# EAGLE design PTT (EAGLE 9.3.1)
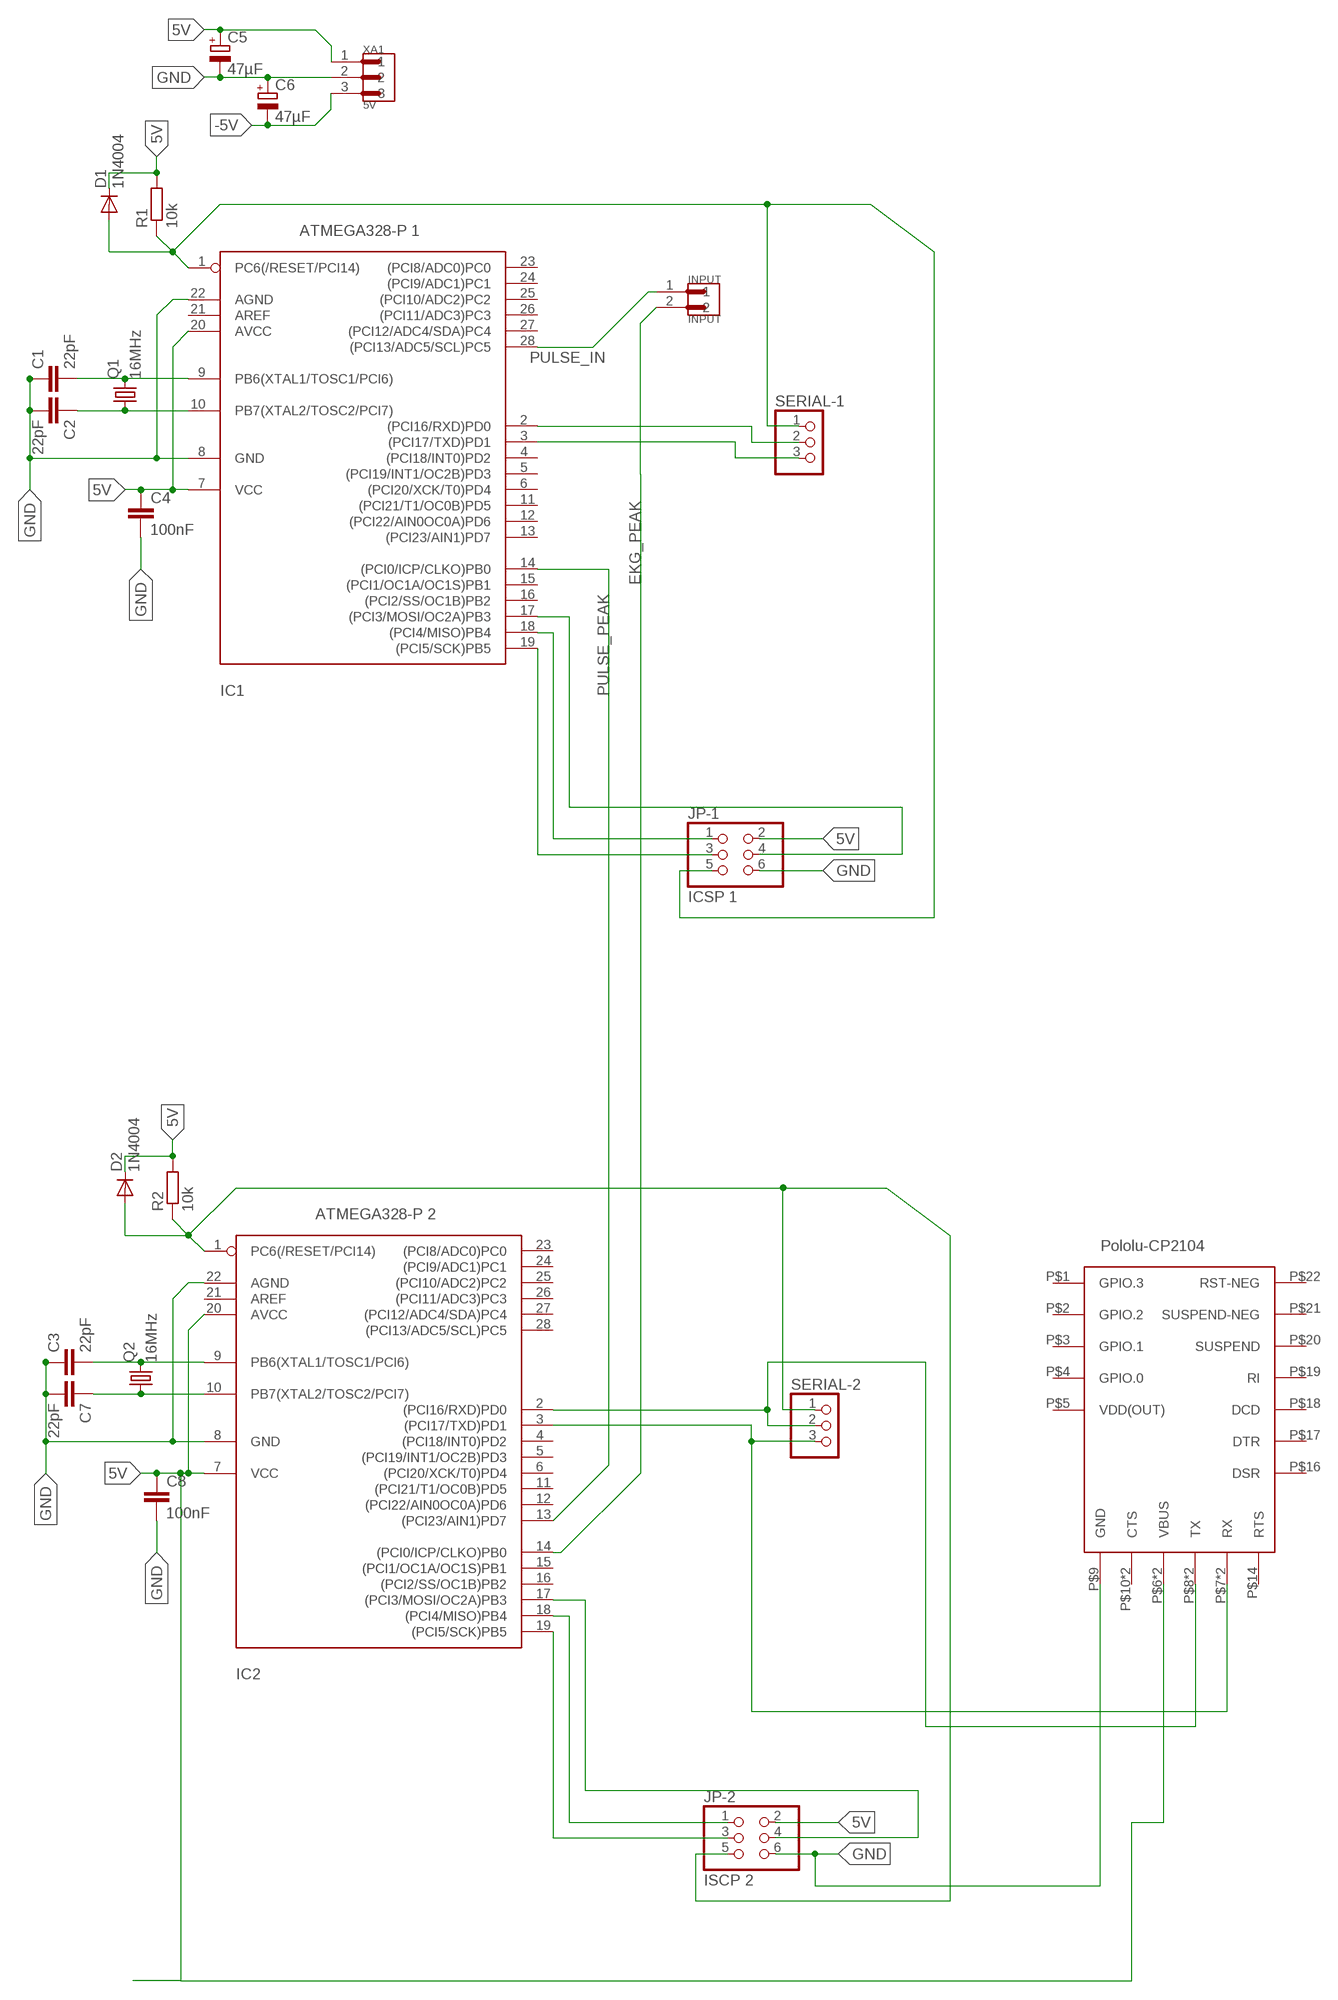
[diagram p0: schematic, sheet 1]

## Parts
C1  22pF  C-EU025-024X044  [C025-024X044]
C2  22pF  C-EU025-024X044  [C025-024X044]
C3  22pF  C-EU025-024X044  [C025-024X044]
C4  100nF  C-EU025-024X044  [C025-024X044]
C5  47µF  CPOL-EUE2,5-6E  [E2,5-6E]
C6  47µF  CPOL-EUE2,5-6E  [E2,5-6E]
C7  22pF  C-EU025-024X044  [C025-024X044]
C8  100nF  C-EU025-024X044  [C025-024X044]
D1  1N4004  [DO41-10]
D2  1N4004  [DO41-10]
IC1  ATMEGA328-P 1  ATMEGA168-20P  [DIL28-3]
IC2  ATMEGA328-P 2  ATMEGA168-20P  [DIL28-3]
INPUT  INPUT  B2P-VH(LF)(SN)  [JST_B2P-VH(LF)(SN)]
JP-1  ICSP 1  PINHD-2X3  [2X03]
JP-2  ISCP 2  PINHD-2X3  [2X03]
Q1  16MHz  CRYSTALHC49U70  [HC49U70]
Q2  16MHz  CRYSTALHC49U70  [HC49U70]
R1  10k  R-EU_0204/7  [0204/7]
R2  10k  R-EU_0204/7  [0204/7]
SERIAL-1  PINHD-1X3  [1X03]
SERIAL-2  PINHD-1X3  [1X03]
U$2  POLOLU_CP2104  [POLOLUCP2104]
XA1  5V  B3P-VH(LF)(SN)  [JST_B3P-VH(LF)(SN)]

## Nets
5V [supply]: C4.1 C5.+ C8.1 D1.C D2.C IC1.7(VCC) IC1.20(AVCC) IC2.7(VCC) IC2.20(AVCC) JP-1.2 JP-2.2 R1.2 R2.2 U$2.P$6(VBUS) U$2.P$11(VBUS) XA1.1
-5V [supply]: C6.- XA1.3
EKG_PEAK: IC2.14((PCI0/ICP/CLKO)PB0) INPUT.2
GND [supply]: C1.1 C2.2 C3.1 C4.2 C5.- C6.+ C7.2 C8.2 IC1.8(GND) IC1.22(AGND) IC2.8(GND) IC2.22(AGND) JP-1.6 JP-2.6 U$2.P$9(GND) XA1.2
N$1: C3.2 IC2.9(PB6(XTAL1/TOSC1/PCI6)) Q2.2
N$2: C7.1 IC2.10(PB7(XTAL2/TOSC2/PCI7)) Q2.1
N$3: IC2.18((PCI4/MISO)PB4) JP-2.1
N$4: IC2.19((PCI5/SCK)PB5) JP-2.3
N$5: IC2.17((PCI3/MOSI/OC2A)PB3) JP-2.4
N$6: IC2.2((PCI16/RXD)PD0) SERIAL-2.2 U$2.P$8(TX) U$2.P$12(TX)
N$7: IC2.3((PCI17/TXD)PD1) SERIAL-2.3 U$2.P$7(RX) U$2.P$13(RX)
N$19: IC1.17((PCI3/MOSI/OC2A)PB3) JP-1.4
N$20: IC1.2((PCI16/RXD)PD0) SERIAL-1.2
N$21: IC1.3((PCI17/TXD)PD1) SERIAL-1.3
N$26: C1.2 IC1.9(PB6(XTAL1/TOSC1/PCI6)) Q1.2
N$27: C2.1 IC1.10(PB7(XTAL2/TOSC2/PCI7)) Q1.1
N$30: IC1.18((PCI4/MISO)PB4) JP-1.1
N$31: IC1.19((PCI5/SCK)PB5) JP-1.3
PULSE_IN: IC1.28((PCI13/ADC5/SCL)PC5) INPUT.1
PULSE_PEAK: IC1.14((PCI0/ICP/CLKO)PB0) IC2.13((PCI23/AIN1)PD7)
RESET: D1.A IC1.1(PC6(/RESET/PCI14)) JP-1.5 R1.1 SERIAL-1.1
RESET1: D2.A IC2.1(PC6(/RESET/PCI14)) JP-2.5 R2.1 SERIAL-2.1
Unconnected: IC1.4((PCI18/INT0)PD2) IC1.5((PCI19/INT1/OC2B)PD3) IC1.6((PCI20/XCK/T0)PD4) IC1.11((PCI21/T1/OC0B)PD5) IC1.12((PCI22/AIN0OC0A)PD6) IC1.13((PCI23/AIN1)PD7) IC1.15((PCI1/OC1A/OC1S)PB1) IC1.16((PCI2/SS/OC1B)PB2) IC1.21(AREF) IC1.23((PCI8/ADC0)PC0) IC1.24((PCI9/ADC1)PC1) IC1.25((PCI10/ADC2)PC2) IC1.26((PCI11/ADC3)PC3) IC1.27((PCI12/ADC4/SDA)PC4) IC2.4((PCI18/INT0)PD2) IC2.5((PCI19/INT1/OC2B)PD3) IC2.6((PCI20/XCK/T0)PD4) IC2.11((PCI21/T1/OC0B)PD5) IC2.12((PCI22/AIN0OC0A)PD6) IC2.15((PCI1/OC1A/OC1S)PB1) IC2.16((PCI2/SS/OC1B)PB2) IC2.21(AREF) IC2.23((PCI8/ADC0)PC0) IC2.24((PCI9/ADC1)PC1) IC2.25((PCI10/ADC2)PC2) IC2.26((PCI11/ADC3)PC3) IC2.27((PCI12/ADC4/SDA)PC4) IC2.28((PCI13/ADC5/SCL)PC5) U$2.P$1(GPIO.3) U$2.P$2(GPIO.2) U$2.P$3(GPIO.1) U$2.P$4(GPIO.0) U$2.P$10(CTS) U$2.P$14(RTS) U$2.P$15(CTS) U$2.P$16(DSR) U$2.P$17(DTR) U$2.P$18(DCD) U$2.P$19(RI) U$2.P$20(SUSPEND) U$2.P$21(SUSPEND-NEG) U$2.P$22(RST-NEG)

## Power pins joined to a net without a drawn wire
VDD(OUT): U$2.P$5(VDD(OUT))

## Library data of the parts
C1-C4 C7 C8 = rcl:C-EU: CAPACITOR, European symbol; SPICEPREFIX: C
C5 C6 = rcl:CPOL-EU: POLARIZED CAPACITOR, European symbol; SPICEPREFIX: C
D1 D2 = diode:1N4004: DIODE general purpose rectifier, 1 A
IC1 IC2 = adafruit:ATMEGA168*P: MICROCONTROLLER 16 kBytes FLASH 1 kBytes SRAM 512 Bytes EEPROM USART 8-channel 10 bit ADC
INPUT = B2P-VH_LF__SN_:B2P-VH(LF)(SN): VH Series 3.96 mm Pitch, Compact, Lock Mechanism also Prevents Misinsertion; AVAILABILITY: Good; DESCRIPTION: VH Series 3.96 mm Pitch, Compact, Lock Mechanism also Prevents Misinsertion; MF: JST; MP: B2P-VH_LF__SN_; PACKAGE: FakePackage u; PRICE: 0.11 USD
JP-1 JP-2 = pinhead:PINHD-2X3: PIN HEADER
Q1 Q2 = adafruit:CRYSTAL: CRYSTAL; OC_FARNELL: unknown; OC_NEWARK: unknown
R1 R2 = rcl:R-EU_: RESISTOR, European symbol; SPICEPREFIX: R
SERIAL-1 SERIAL-2 = pinhead:PINHD-1X3: PIN HEADER
U$2 = POLOLU_CP2104:POLOLU_CP2104: TTL zu USB Konverter
XA1 = B3P-VH_LF__SN_:B3P-VH(LF)(SN): VH Series 3 Position 3.96 mm Pitch Through Hole Crimp Locking Header; AVAILABILITY: Good; DESCRIPTION: VH Series 3 Position 3.96 mm Pitch Through Hole Crimp Locking Header; MF: JST; MP: B3P-VH_LF__SN_; PACKAGE: FakePackage u; PRICE: 0.12 USD

## Net classes
0 signals: width 0.406 mm, clearance 0.305 mm
1 supply: width 0.61 mm, clearance 0.406 mm

## Board
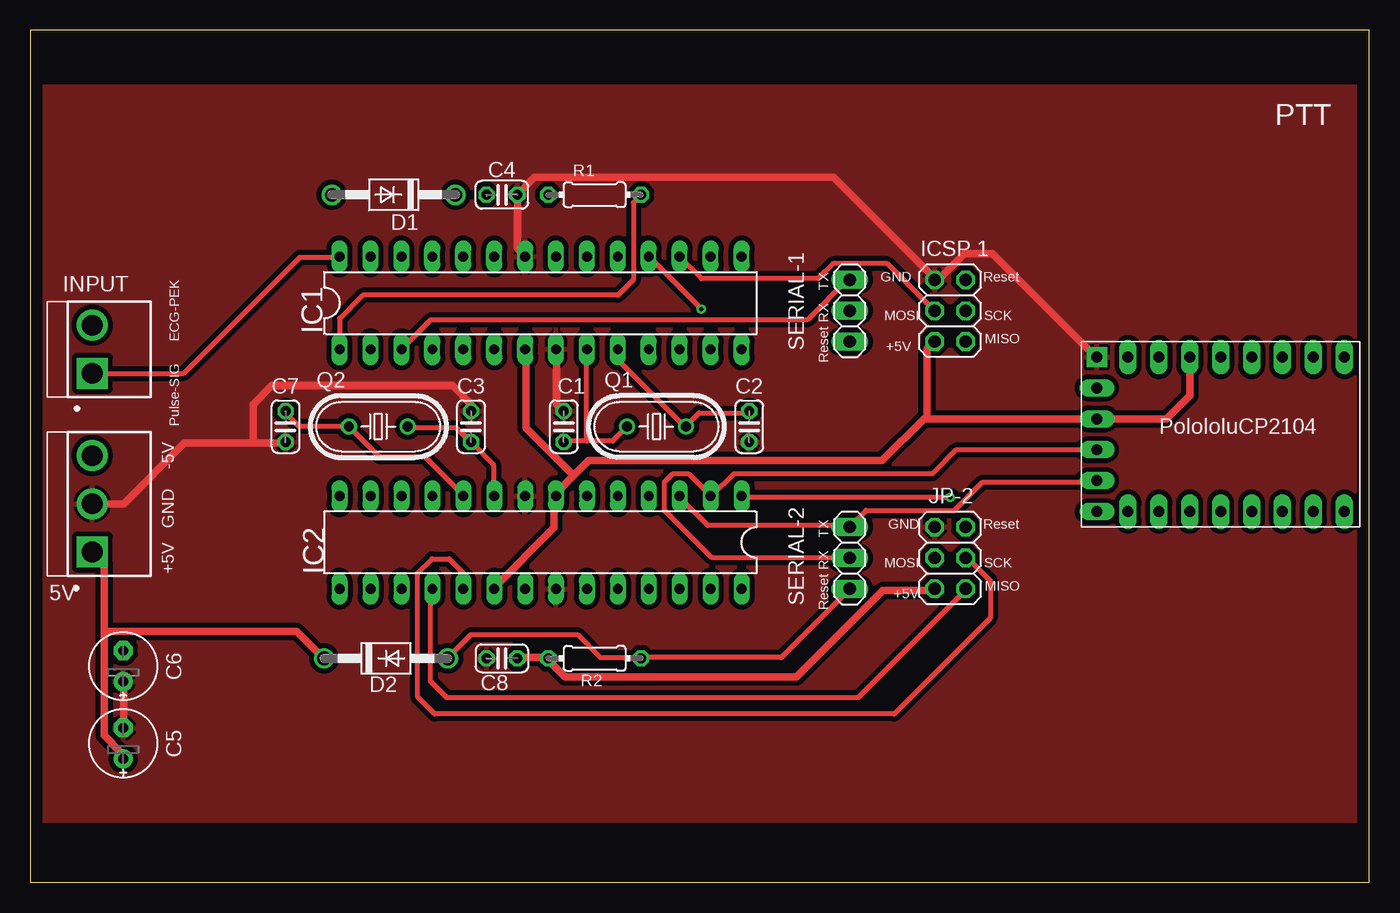
[diagram p1: board, top side]
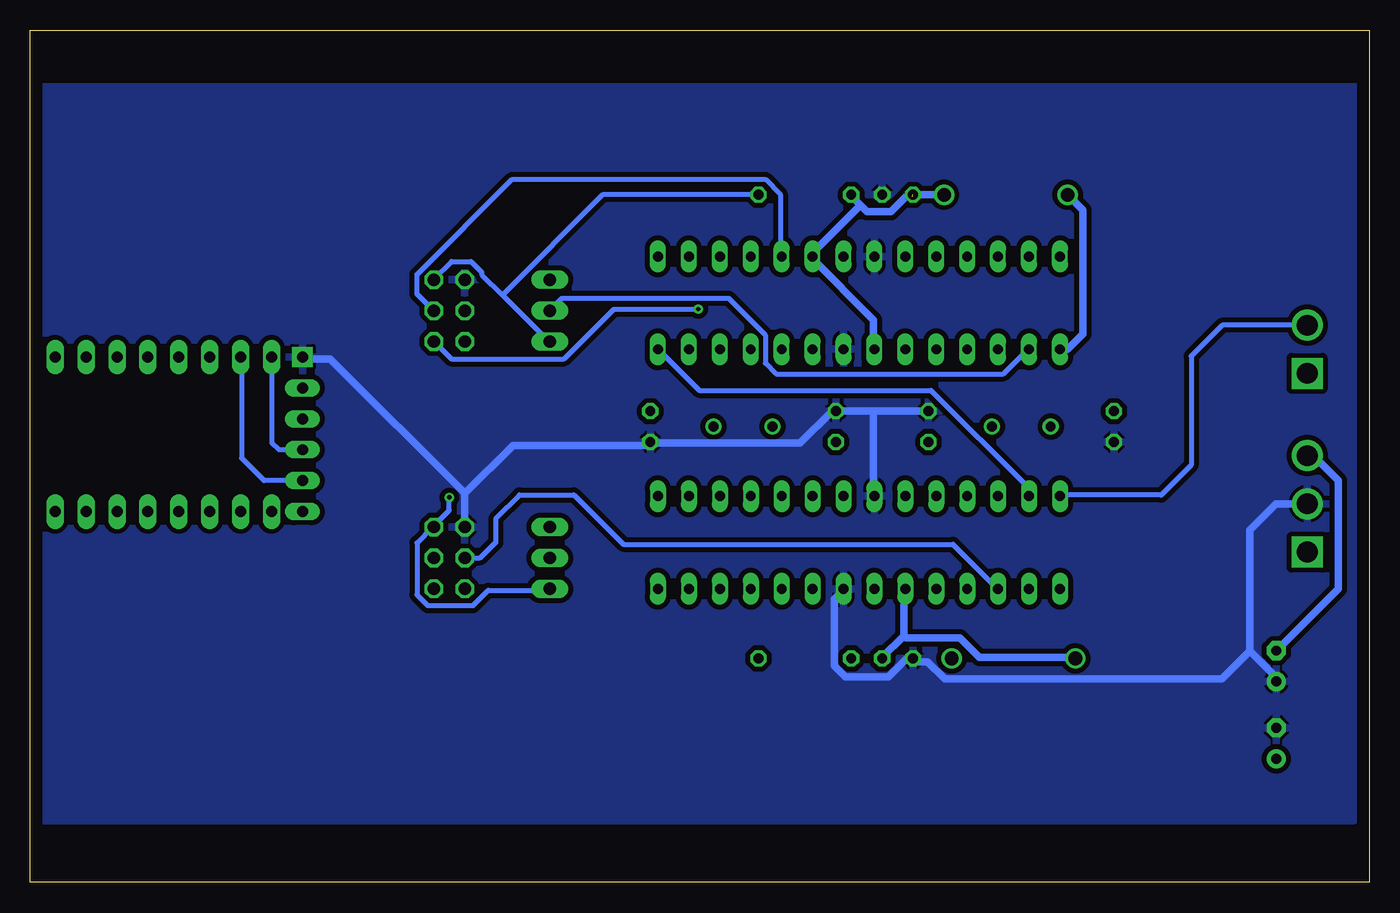
[diagram p2: board, bottom side, seen from below]

Size 109.98 x 70.02 mm. Coordinates in mm from the lower left corner, seen from the top.
Outline: 0,0 109.98,0 109.98,70.02 0,70.02 0,0
Copper layers (1*16): Top 0.035mm / dielectric 1.5mm / Bottom 0.035mm
Design rules "default": minimum track width 6mil, minimum drill 0.35mm, track to track 6mil, track to pad 6mil, pad to pad 6mil, via to via 6mil, smd to smd 6mil, copper to edge 40mil, drill to drill 6mil, minimum pad ring 10mil, minimum via ring 8mil, stop-mask expansion 4mil, vias tented up to drill 0mil, thermal gap 10mil

### Footprints (pad centres in the part's own frame; a part is rotated, then mirrored left to right if it is on the bottom)
C025-024X044 = drill 0.813 octagon: 1 -1.27,0; 2 1.27,0
E2,5-6E = drill 0.813 pad 1.575: + -1.27,0 | drill 0.813 pad 1.575 octagon: - 1.27,0
DO41-10 = drill 1.118: A 5.08,0; C -5.08,0
DIL28-3 = drill 0.813 long: 1 -16.51,-3.81; 2 -13.97,-3.81; 3 -11.43,-3.81; 4 -8.89,-3.81; 5 -6.35,-3.81; 6 -3.81,-3.81; 7 -1.27,-3.81; 8 1.27,-3.81; 9 3.81,-3.81; 10 6.35,-3.81; 11 8.89,-3.81; 12 11.43,-3.81; 13 13.97,-3.81; 14 16.51,-3.81; 15 16.51,3.81; 16 13.97,3.81; 17 11.43,3.81; 18 8.89,3.81; 19 6.35,3.81; 20 3.81,3.81; 21 1.27,3.81; 22 -1.27,3.81; 23 -3.81,3.81; 24 -6.35,3.81; 25 -8.89,3.81; 26 -11.43,3.81; 27 -13.97,3.81; 28 -16.51,3.81
JST_B2P-VH(LF)(SN) = drill 1.7 square: 1 -1.98,0 | drill 1.7: 2 1.98,0
2X03 = drill 1.016 octagon: 1 -2.54,-1.27; 2 -2.54,1.27; 3 0,-1.27; 4 0,1.27; 5 2.54,-1.27; 6 2.54,1.27
HC49U70 = drill 0.813: 1 -2.413,0; 2 2.413,0
0204/7 = drill 0.813 octagon: 1 -3.81,0; 2 3.81,0
1X03 = drill 1.016 long: 1 -2.54,0; 2 0,0; 3 2.54,0
POLOLUCP2104 = drill 0.9 pad 1.422 long: P$1 1.27,-1.27; P$2 1.27,-3.81; P$3 1.27,-6.35; P$4 1.27,-8.89; P$5 1.27,-11.43; P$6 1.27,-13.97; P$7 1.27,-16.51; P$8 1.27,-19.05; P$10 3.81,-21.59; P$11 6.35,-21.59; P$12 8.89,-21.59; P$13 11.43,-21.59; P$14 13.97,-21.59; P$15 13.97,-19.05; P$16 13.97,-16.51; P$17 13.97,-13.97; P$18 13.97,-11.43; P$19 13.97,-8.89; P$20 13.97,-6.35; P$21 13.97,-3.81; P$22 13.97,-1.27 | drill 0.9 pad 1.676 square: P$9 1.27,-21.59
JST_B3P-VH(LF)(SN) = drill 1.7 square: 1 -3.96,0 | drill 1.7: 2 0,0; 3 3.96,0

### Placement (x,y rotation side)
C1  43.81,37.47 270 top
C2  59.05,37.47 270 top
C3  36.2,37.47 270 top
C4  38.73,56.52 0 top
C5  7.62,11.43 90 top
C6  7.62,17.78 90 top
C7  20.95,37.47 270 top
C8  38.73,18.41 180 top
D1  29.84,56.52 180 top
D2  29.21,18.41 0 top
IC1  41.91,47.62 0 top
IC2  41.91,27.94 180 top
INPUT  5.08,43.81 90 top
JP-1  75.56,46.99 90 top
JP-2  75.56,26.67 90 top
Q1  51.44,37.47 180 top
Q2  28.57,37.47 0 top
R1  46.35,56.52 180 top
R2  46.35,18.41 180 top
SERIAL-1  67.31,46.99 90 top
SERIAL-2  67.31,26.67 90 top
U$2  109.22,44.45 270 top
XA1  5.08,31.11 90 top

### Tracks (layer width: path | path; a pad name or v marks a point on that pad's centre or on a via)
5V  (1 unrouted)
  Top 0.61: 6.04,20.62 6.04,12.09 7.47,10.67 7.47,10.31 C5.+ | C8.1 40.01,18.49 42.49,18.49 R2.2 42.67,18.14 43.92,16.89 62.94,16.89 70.05,24 74.14,24 JP-2.2 | IC2.20 38.05,24.18 43.03,29.16 43.03,31.65 IC2.7 43.2,32 44.63,33.43 | 73.66,38.1 73.41,38.1 69.98,34.67 45.87,34.67 44.63,33.43 | 6.04,20.62 21.87,20.62 24,18.49 D2.C | 44.63,33.43 40.72,37.34 40.72,43.74 IC1.7 | JP-1.2 73.66,43.81 73.66,38.1 | 73.66,38.1 U$2.P$11 93.34,38.1 95.25,40.01 U$2.P$6 | XA1.1 6.04,26.19 6.04,20.62
  Bottom 0.61: IC1.7 40.72,43.92 40.72,46.23 45.87,51.38 IC1.20 45.7,51.74 41.78,55.65 | 37.52,56.36 38.05,56.36 39.29,55.12 41.25,55.12 41.78,55.65 | 41.78,55.65 42.49,56.36 R1.2 | 37.34,56.19 C4.1 D1.C | 38.23,20.27 38.23,24 IC2.20 | 38.23,20.27 40.01,18.49 C8.1 | D2.C 24.18,18.49 32,18.49 33.6,20.09 38.05,20.09 38.23,20.27
-5V
  Bottom 0.61: 7.47,19.2 C6.- 2.54,24.13 2.54,33.02 4.59,35.08 XA1.3
EKG_PEAK
  Bottom 0.406: INPUT.2 12.06,45.8 14.61,43.26 14.61,34.29 17.07,31.83 25.25,31.83 IC2.14
GND
  Top 0.61: U$2.P$9 87.48,43.2 79.02,51.66 76.73,51.66 74.68,49.61 74.32,49.61 JP-1.6 74.14,49.78 65.96,57.96 41.43,57.96 40.01,56.54 C4.2 40.01,52.07 IC1.22 | IC1.8 43.2,43.74 43.2,39.29 43.74,38.76 C1.1 | C5.- 7.64,12.8 7.64,16.36 C6.+ | 18.29,36.09 12.62,36.09 7.64,31.11 XA1.2 | 18.29,36.09 20.8,36.09 C7.2 | C3.1 36.2,39.29 34.67,40.82 19.81,40.82 18.29,39.29 18.29,36.09
  Bottom 0.61: 40.72,38.76 43.74,38.76 C1.1 44.09,38.76 46.76,36.09 59.03,36.09 C2.2 59.21,35.92 70.33,35.92 74.3,31.95 JP-2.6 74.32,29.52 74.32,32 85.34,43.03 87.48,43.03 U$2.P$9 | 40.72,38.76 36.27,38.76 C3.1 | 40.72,38.76 40.72,31.83 IC2.8 | IC2.22 43.2,24 43.92,23.29 43.92,17.78 43.03,16.89 39.47,16.89 38.05,18.31 37.52,18.31 C8.2 37.34,18.14 36.27,18.14 34.85,16.71 12.09,16.71 9.78,19.02 | 9.78,19.02 7.64,16.89 7.64,16.54 C6.+ | 9.78,19.02 9.78,28.98 7.64,31.11 XA1.2
  pour Bottom: 0.64,65.41 109.22,65.41 109.22,5.08 1.27,5.08 0.64,5.71
  pour Top: 0,5.08 0,64.77 0.64,65.41 109.86,65.41 109.86,5.08
N$1
  Top 0.406: IC2.9 38.05,31.83 38.05,34.31 36.27,36.09 C3.2 36.09,36.27 35.03,37.34 31.11,37.34 Q2.2
N$2
  Top 0.406: C7.1 20.98,38.58 22.05,37.52 26.14,37.52 Q2.1 26.31,37.34 28.65,35 32.38,35 35.56,31.83 IC2.10
N$3
  Top 0.406: IC2.18 32.89,24 32.89,16.51 34.21,15.19 68,15.19 76.81,24 JP-2.1
N$4
  Top 0.406: IC2.19 35.56,25.45 34.42,26.59 32.99,26.59 31.83,25.43 31.83,15.24 33.22,13.84 70.97,13.84 78.87,21.74 78.87,24.79 76.99,26.67 JP-2.3
N$5
  Bottom 0.406: JP-2.4 73.03,26.67 71.75,27.94 71.75,29.9 69.8,31.85 65.33,31.85 61.27,27.79 34.19,27.79 30.58,24.18 IC2.17
N$6
  Top 0.406: SERIAL-2.2 56.01,26.67 52.09,30.58 52.09,32.89 52.81,33.6 54.05,33.6 55.83,31.83 IC2.2 56.01,31.83 57.78,33.6 74.14,33.6 76.1,35.56 U$2.P$12
  Bottom 0.406: U$2.P$12 89.56,35.56 90.14,36.14 90.14,43.03 U$2.P$8
N$7
  Top 0.406: IC2.3 53.34,31.65 55.65,29.34 67.21,29.34 SERIAL-2.3 67.39,29.34 68.63,30.58 75.92,30.58 78.23,32.89 87.48,32.89 U$2.P$13
  Bottom 0.406: U$2.P$13 90.78,33.02 92.63,34.87 92.63,43.03 U$2.P$7
N$19
  Top 0.406: IC1.17 53.34,51.38 55.12,49.61 64.72,49.61 65.96,50.85 70.41,50.85 74.14,47.12 JP-1.4
N$20
  Bottom 0.406: IC1.2 28.09,43.74 30.05,41.78 48.72,41.78 49.61,42.67 49.61,44.98 52.63,48.01 66.32,48.01 67.21,47.12 SERIAL-1.2
N$21
  Top 0.406: IC1.3 30.58,43.92 32.89,46.23 63.83,46.23 67.21,49.61 SERIAL-1.3
N$26
  Top 0.406: 45.7,36.27 47.83,36.27 48.9,37.34 Q1.2 | 45.7,36.27 43.92,36.27 C1.2 | IC1.9 45.7,43.74 45.7,36.45 45.7,36.27
N$27
  Top 0.406: IC1.10 48.36,43.74 48.36,42.85 53.7,37.52 Q1.1 53.87,37.52 54.94,38.58 59.03,38.58 C2.1
N$30  (via drill 0.35)
  Top 0.406: v55.12,47.12 50.85,51.38 IC1.18
  Bottom 0.406: v55.12,47.12 62.05,47.12 66.14,43.03 75.39,43.03 76.81,44.45 JP-1.1
N$31
  Bottom 0.406: IC1.19 48.36,51.56 48.36,56.54 49.61,57.78 70.41,57.78 78.23,49.96 78.23,48.36 76.99,47.12 JP-1.3
PULSE_IN
  Top 0.406: INPUT.1 12.6,41.84 22.15,51.38 25.25,51.38 IC1.28
PULSE_PEAK
  Bottom 0.406: IC2.13 28.09,31.83 28.09,32.54 35.99,40.44 55.02,40.44 58.32,43.74 IC1.14
RESET
  Top 0.406: R1.1 49.53,55.88 49.53,49.53 48.26,48.26 27.3,48.26 25.4,46.35 IC1.1
  Bottom 0.406: 71.21,48.27 72.9,49.96 72.9,50.14 73.79,51.03 75.39,51.03 76.81,49.61 JP-1.5 | 71.21,48.27 67.39,44.45 SERIAL-1.1 | 71.21,48.27 62.97,56.52 R1.1
  Bottom 0.61: D1.A 23.5,55.24 23.5,45.09 24.77,43.81 IC1.1
RESET1  (via drill 0.35)
  Top 0.406: D2.A 34.31,18.49 36.2,20.37 44.93,20.37 46.81,18.49 50.14,18.49 R2.1 50.32,18.49 61.7,18.49 67.21,24 SERIAL-2.1 | v75.56,31.65 58.5,31.65 IC2.1
  Bottom 0.406: v75.56,31.65 75.56,30.58 76.81,29.34 JP-2.5 76.99,29.16 78.23,27.91 78.23,23.65 77.34,22.76 73.61,22.76 72.36,24 67.39,24 SERIAL-2.1

### Text on the board
tNames: PTT | ECG-PEK | TX | GND | Reset | RX | MOSI | SCK | Reset | MISO | +5V | Pulse-SIG | -5V | GND | TX | GND | Reset | +5V | RX | MOSI | SCK | Reset | MISO | +5V